# Altium schematic sheet EVK-NORA-W1_SCHEM_0002_Power.SchDoc
size B; Date: 7/24/2020; CompanyName: U-blox; DrawnBy: EMOO; Engineer: EMOO; Organization: U-blox; Address1: 3950 Fairview Industrial Dr SE #100; Address2: Salem, OR 97302; SheetNumber: 2; SheetTotal: 6; SheetSize: B; SheetTitle: Power
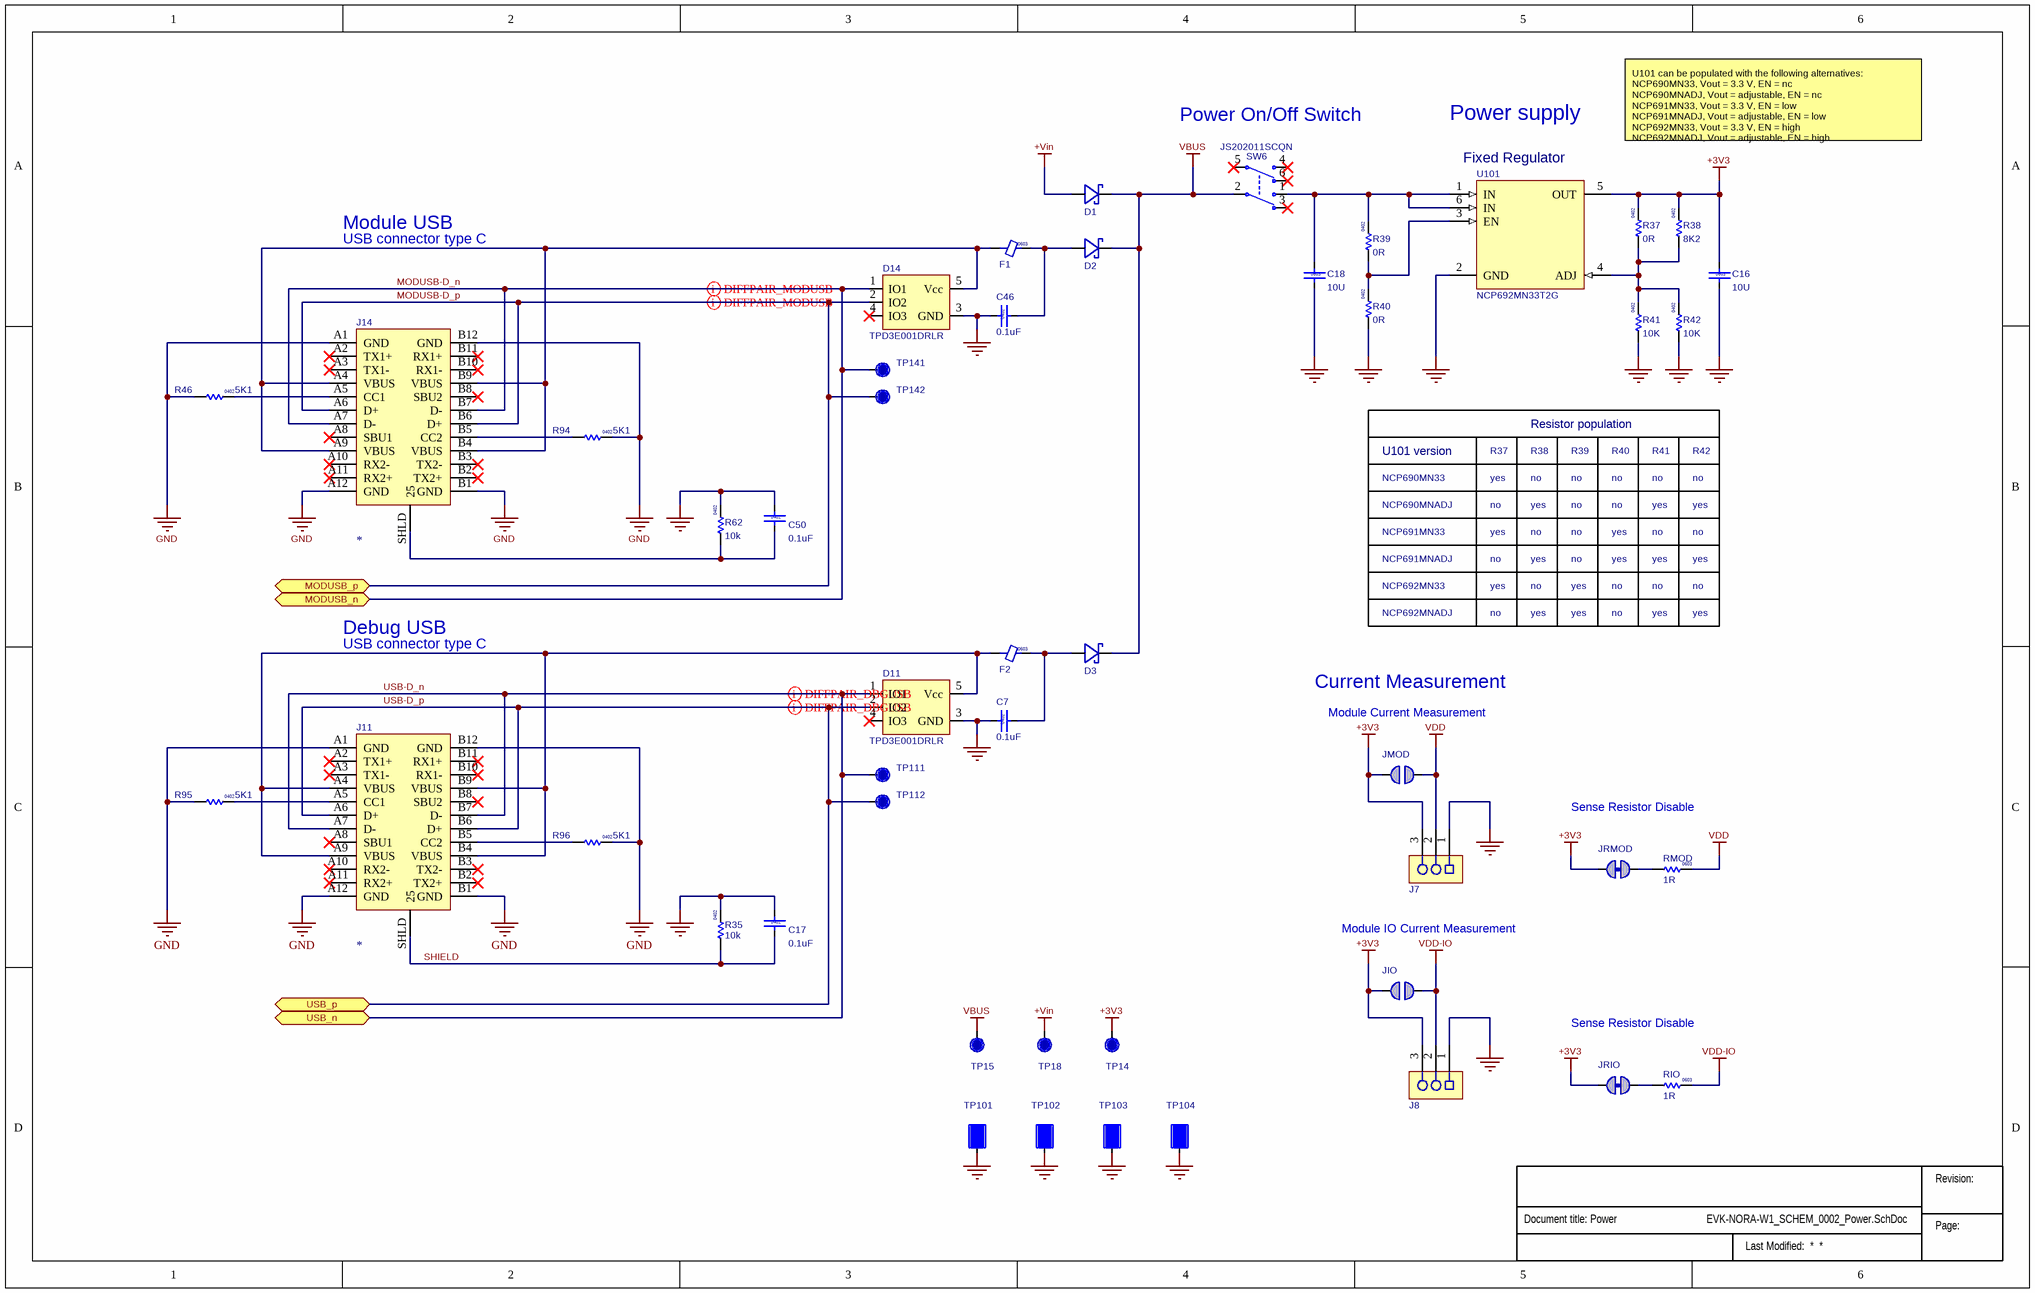
[diagram p0: EVK-NORA-W1_SCHEM_0002_Power.SchDoc]

## Parts
?  (no value)  (graphical)
C7  value 0.1uF  Size: 0402  [Cap 0402 HD]  (hidden comment: 120-000160.1uF)
C16  value 10U  Size: 0603  [Cap 0603 HD]
C17  value 0.1uF  Size: 0402  [Cap 0402 HD]  (hidden comment: 120-000160.1uF)
C18  value 10U  Size: 0603  [Cap 0603 HD]
C46  value 0.1uF  Size: 0402  [Cap 0402 HD]  (hidden comment: 120-000160.1uF)
C50  value 0.1uF  Size: 0402  [Cap 0402 HD]  (hidden comment: 120-000160.1uF)
D1  (no value)  [SOD-123F_U]
D2  (no value)  [SOD-123F_U]
D3  (no value)  [SOD-123F_U]
D11  Manufacturer P/N: TPD3E001DRLR  [SOT-553]  (hidden comment: 110-00018)
D14  Manufacturer P/N: TPD3E001DRLR  [SOT-553]  (hidden comment: 110-00018)
F1  Size: 0603  [IND 0603 HD]
F2  Size: 0603  [IND 0603 HD]
J7  130-00105  [HDR-0.1P-3Pin-1Row-SMT]  (value not drawn)
J8  130-00105  [HDR-0.1P-3Pin-1Row-SMT]  (value not drawn)
J11  (no value)  [CON_USB-C-RA_W-6Tabs]
J14  (no value)  [CON_USB-C-RA_W-6Tabs]
JIO  Solderbridge-OpenDNP  [Solderbridge-Open]  (value not drawn)  (no BOM)
JMOD  Solderbridge-OpenDNP  [Solderbridge-Open]  (value not drawn)  (no BOM)
JRIO  Solderbridge-ShortDNP  [Solderbridge-Short]  (value not drawn)  (net tie, no BOM)
JRMOD  Solderbridge-ShortDNP  [Solderbridge-Short]  (value not drawn)  (net tie, no BOM)
R35  value 10k  Size: 0402  [RES 0402 HD]  (hidden comment: 180-0002410k)
R37  value 0R  Size: 0402  [RES 0402 HD]
R38  value 8K2  Size: 0402  [RES 0402 HD]
R39  value 0R  Size: 0402  [RES 0402 HD]
R40  value 0R  Size: 0402  [RES 0402 HD]
R41  value 10K  Size: 0402  [RES 0402 HD]
R42  value 10K  Size: 0402  [RES 0402 HD]
R46  value 5K1  Size: 0402  [RES 0402 HD]
R62  value 10k  Size: 0402  [RES 0402 HD]  (hidden comment: 180-0002410k)
R94  value 5K1  Size: 0402  [RES 0402 HD]
R95  value 5K1  Size: 0402  [RES 0402 HD]
R96  value 5K1  Size: 0402  [RES 0402 HD]
RIO  value 1R  Size: 0603  [RES 0603 HD]  (hidden comment: 180-001091R)
RMOD  value 1R  Size: 0603  [RES 0603 HD]  (hidden comment: 180-001091R)
SW6  Manufacturer P/N: JS202011SCQN  [SW_Slide_DPDT_JS202011SCQN]  (hidden comment: 137-00006)
TP14  TP  [TP10R]  (value not drawn)  (no BOM)
TP15  TP  [TP10R]  (value not drawn)  (no BOM)
TP18  TP  [TP10R]  (value not drawn)  (no BOM)
TP101  TP4.5x3SqDNP  [TP4.5x3Sq]  (value not drawn)  (no BOM)
TP102  TP4.5x3SqDNP  [TP4.5x3Sq]  (value not drawn)  (no BOM)
TP103  TP4.5x3SqDNP  [TP4.5x3Sq]  (value not drawn)  (no BOM)
TP104  TP4.5x3SqDNP  [TP4.5x3Sq]  (value not drawn)  (no BOM)
TP111  TP  [TP10R]  (value not drawn)  (no BOM)
TP112  TP  [TP10R]  (value not drawn)  (no BOM)
TP141  TP  [TP10R]  (value not drawn)  (no BOM)
TP142  TP  [TP10R]  (value not drawn)  (no BOM)
U101  NCP692MN33T2G  [DFN-PSON.1P3X3-7pin_HS-7N]

## Ports
MODUSB_n (bidir), MODUSB_p (bidir), USB_n (bidir), USB_p (bidir)

## Nets
+3V3: C16.1 J7.3 J8.3 JIO.2 JMOD.2 JRIO.2 JRMOD.2 R37.2 R38.2 TP14.1 U101.5(OUT)
+Vin: D1.A(Anode) TP18.1
GND: C7.1 C16.2 C17.1 C18.2 C46.1 C50.1 D11.3(GND) D14.3(GND) J7.1 J8.1 J11.A1(GND) J11.A12(GND) J11.B1(GND) J11.B12(GND) J14.A1(GND) J14.A12(GND) J14.B1(GND) J14.B12(GND) R35.2 R40.1 R41.1 R42.1 R46.1 R62.2 R94.2 R95.1 R96.2 TP101.1 TP102.1 TP103.1 TP104.1 U101.2(GND)
VBUS: D1.C(Cathode) D2.C(Cathode) D3.C(Cathode) SW6.2(COM-1) TP15.1
VDD: J7.2 JMOD.1 RMOD.2
VDD-IO: J8.2 JIO.1 RIO.2
MODUSB-D_n: D14.1(IO1) J14.A7(D-) J14.B7(D-) TP141.1 ; port MODUSB_n
MODUSB-D_p: D14.2(IO2) J14.A6(D+) J14.B6(D+) TP142.1 ; port MODUSB_p
SHIELD: C17.2 J11.SHLD(25) R35.1
USB-D_n: D11.1(IO1) J11.A7(D-) J11.B7(D-) TP111.1 ; port USB_n
USB-D_p: D11.2(IO2) J11.A6(D+) J11.B6(D+) TP112.1 ; port USB_p
NetC7_2: C7.2 D3.A(Anode) F2.2
NetC18_1: C18.1 R39.2 SW6.1(N.O-1) U101.1(IN) U101.6(IN)
NetC46_2: C46.2 D2.A(Anode) F1.2
NetC50_2: C50.2 J14.SHLD(25) R62.1
NetD11_5: D11.5(Vcc) F2.1 J11.A4(VBUS) J11.A9(VBUS) J11.B4(VBUS) J11.B9(VBUS)
NetD14_5: D14.5(Vcc) F1.1 J14.A4(VBUS) J14.A9(VBUS) J14.B4(VBUS) J14.B9(VBUS)
NetJ11_A5: J11.A5(CC1) R95.2
NetJ11_B5: J11.B5(CC2) R96.1
NetJ14_A5: J14.A5(CC1) R46.2
NetJ14_B5: J14.B5(CC2) R94.1
NetJRIO_1: JRIO.1 RIO.1
NetJRMOD_1: JRMOD.1 RMOD.1
NetR37_1: R37.1 R38.1 R41.2 R42.2 U101.4(ADJ)
NetR39_1: R39.1 R40.2 U101.3(EN)

Not connected (* = marked no-connect by the designer): D11 4(IO3)*; D14 4(IO3)*; J11 A2(TX1+)* A3(TX1-)* A8(SBU1)* A10(RX2-)* A11(RX2+)* B2(TX2+)* B3(TX2-)* B8(SBU2)* B10(RX1-)* B11(RX1+)*; J14 A2(TX1+)* A3(TX1-)* A8(SBU1)* A10(RX2-)* A11(RX2+)* B2(TX2+)* B3(TX2-)* B8(SBU2)* B10(RX1-)* B11(RX1+)*; SW6 3(N.C-1)* 4(N.O-2)* 5(COM-2)* 6(N.C-2)*

## Layout directives
differential pair; net class USB_DIFF: MODUSB-D_n, MODUSB-D_p, USB-D_n, USB-D_p

## Notes on the sheet
- (near SW6) Power On/Off Switch
- Power supply
- (near U101) Fixed Regulator
- U101 can be populated with the following alternatives:
  NCP690MN33, Vout = 3.3 V, EN = nc
  NCP690MNADJ, Vout = adjustable, EN = nc
  NCP691MN33, Vout = 3.3 V, EN = low
  NCP691MNADJ, Vout = adjustable, EN = low
  NCP692MN33, Vout = 3.3 V, EN = high
  NCP692MNADJ, Vout = adjustable, EN = high
- Module USB
- USB connector type C
- Resistor population
- NCP690MN33
- NCP690MNADJ
- U101 version
- R37
- yes
- no
- R38
- R39
- R40
- R41
- R42
- NCP691MN33
- NCP691MNADJ
- Debug USB
- NCP692MN33
- NCP692MNADJ
- Current Measurement
- Module Current Measurement
- Sense Resistor Disable
- Module IO Current Measurement
- Revision:
- Page:

## Library data of the parts
? = Sub_Title_Block: Minimized schematic title block for all subset sheets
C7 C17 C46 C50 = 120-00016: Cap, Ceramic 0.1uF 10V 10% X5R 0402; Part Name: CAP CER 0.1UF 10V 10% X5R 0402; Part_Type: Ceramic Capacitor; Manufacturer: Murata Electronics North America; Manufacturer P/N: GRM155R61A104KA01J; Item_Phase: Production; Component Mounting Type: SMT; Tolerance: +/- 10%; Use in new designs: Yes; Part Number: 120-00016; Revision: 0A; Supplier 1: Digi-Key; Supplier Part Number 1: 490-6297-1-ND; Manufacturer 2: Yageo; Manufacturer P/N 2: CC0402KRX5R6BB104; Supplier 2: Digi-Key; Supplier Part Number 2: 311-1336-1-ND; Arena Link: https://app.bom.com/a/GYHPV2L2L43KRMBK?v=spec.summary; Height: 0.55mm; Pins: 2; Temperature Coefficient: X5R; Voltage: 10V
C16 C18 = UBXH01-0000310: CAP CER X7R 0603 10U 20% 10V; Manufacturer: Murata Manufacturing Company, Ltd.; Manufacturer P/N: GRM188Z71A106MA73; Editor: michael.hein; Released by: martin.grasse; Env: ROHS; Permitted Use: Volume Products; Perferred: PREF; Mfg P/N Status: Active; Mfg P/N Split: 100; Mfg P/N Released: Yes; Part Number: UBXH01-0000310; Tolerance: 20%; Max Voltage: 10V; Min Operating Temp: -55°C; Max Operating Temp: 125°C; Part Type: Capacitor; Release Data: 2017-02-09 11:14:05.871832; UBX Wiki: https://wiki.u-blox.com/bin/view/Operations/PartDetails?index=26280; RefDes: C; Mfg P/N Datasheet: https://wiki.u-blox.com/bin/view/Generic/Docs/DocumentSummary?index=26282; Manufacturer 2: Murata Manufacturing Company, Ltd.; Manufacturer P/N 2: GRM188Z71A106KA73; Mfg P/N Status 2: Active; Mfg P/N Split 2: 0; Mfg P/N Released 2: Yes; Mfg P/N Datasheet 2: https://wiki.u-blox.com/bin/view/Generic/Docs/DocumentSummary?index=28416
D1-D3 = 110-00005: Diode, Schottky, 20V 1A SOD-123F, 340mV Vf @ 1A / MBR120VLSFT3G; Manufacturer 1: ON Semiconductor; Part Name: Diode Schottky 20V 1A SOD-123FL; Body Size: None; Item Phase: In Production; MFG Package: SOD-123FL; Use in new designs: Yes; Part Number: 110-00005; Manufacturer Part Number 1: MBR120VLSFT3G; Supplier 1: Digi-Key; Supplier Part Number 1: MBR120VLSFT3GOSCT-ND; Manufacturer 2: None; Manufacturer Part Number 2: None; Supplier 2: None; Supplier Part Number 2: None; Current: 1A; Height: 0.98mm; Max Operating Temp: 125; Min Operating Temp: -65; Pins: 2; Revision: 0B; Voltage: 20V; UBX Code: None
D11 D14 = 110-00018: LOW-CAPACITANCE 3-CHANNEL ESD-PROTECTION ARRAY; Part Name: TVS Diode, 3CH High Speed ESD; Part_Type: Diode; Manufacturer: Texas Instruments; Item_Phase: Production; Body Size: 1.6mm x 1.2mm; Component Mounting Type: SMT; Diode Type: TVS; Use in new designs: Yes; Voltage: 5V; Part Number: 110-00018; Revision: 0A; Supplier 1: Digi-Key; Supplier Part Number 1: 296-21885-1-ND; Arena Link: https://app.bom.com/a/UCV39GZGZIHX50AE?v=spec.summary; Height: .55mm; MFG Package: SOT-553; Package Type: SOT; Pins: 5
F1 F2 = UBXH08-0000001: FERRITE BEAD 0603 600 OHM AT 100MHZ 600OHM 500mA; Manufacturer: TDK Corporation; Manufacturer P/N: MMZ1608B601C; Editor: daniel.hurni; Released by: martin.frauchiger; Env: ROHS; Permitted Use: Support Products; Perferred: PREF; Mfg P/N Status: Active; Mfg P/N Split: 100; Mfg P/N Released: Yes; Part Number: UBXH08-0000001; Value: 600OHM; Max Current: 500mA; Min Operating Temp: -40°C; Max Operating Temp: 125°C; Part Type: Ferrite; Release Data: 2009-12-02 10:18:36.177919; UBX Wiki: https://wiki.u-blox.com/bin/view/Operations/PartDetails?index=7960; RefDes: FB; Mfg P/N Datasheet: https://wiki.u-blox.com/bin/view/Generic/Docs/DocumentSummary?index=7941
J7 J8 = 130-00105: Header, 0.100" Pitch, 3 Pin, Vertical SMT; Manufacturer P/N: M20-8770342; Part Name: CON HDR 0.1" 3 Pin SMT; Part_Type: Connector; Manufacturer: Harwin Inc; Item_Phase: Preliminary; Keyed: No; Rows: 1; Use in new designs: Yes; Part Number: 130-00105; Supplier 1: Digi-Key; Supplier Part Number 1: 952-1951-ND; Arena Link: https://app.bom.com/a/BTCKQXGXGZYCIWHE?v=spec.summary; Color: Black; Component Mounting Type: SMT; Connector Type: Header; Height: 9.93mm; Length: 7.62mm; Locking: No; Pin Pitch: 0.100"; Pins: 3; Width: 5.08mm
J11 J14 = 130-00150: Connector, USB-C Receptacle, 24 Position, Surface Mount, Right Angle, Horizontal, 20V; Manufacturer 1: JAE Electronics; Manufacturer Part Number 1: DX07S024JJ3R1300; Part Name: CON USB C 0.5 mm 24 Pin 2 Row Right Angle White; Item Phase: Unreleased; Use in new designs: Yes; UBX Code: None; Manufacturer P/N: *; Part Number: 130-00150; Supplier 1: Digi-Key; Supplier Part Number 1: 670-2846-1-ND; Diameter: None; Height: 3.29mm; Max Operating Temp: 80; Min Operating Temp: -30; Pins: 24; Revision: None; Voltage: 20V; Manufacturer 2: None; Manufacturer Part Number 2: None; Supplier 2: None; Supplier Part Number 2: None
JIO JMOD = Solderbridge-Open: Added By: Paul B; Part Number: Solderbridge-Open; Height: 0; DNP: DNP; Added Date: 12/2/2015
JRIO JRMOD = Solderbridge-Short: Added By: Paul B; Part Number: Solderbridge-Short; Height: 0; DNP: DNP; Added Date: 12/2/2015
R35 R62 = 180-00024: Resistor 10k ohm 1% 1/16W, 0402; Part Name: RES SMD 10K OHM 1% 1/16W 0402; Manufacturer: Rohm Semiconductor; Manufacturer P/N: MCR01MRTF1002; Item_Phase: Production; Component Mounting Type: SMT; Tolerance: +/- 1%; Use in new designs: Yes; Part Number: 180-00024; Part_Type: Resistor; Revision: 0A; Supplier 1: Digi-Key; Supplier Part Number 1: RHM10.0KCDCT-ND; Manufacturer 2: Samsung Electro-Mechanics America, Inc; Manufacturer P/N 2: RC1005F103CS; Arena Link: https://app.bom.com/a/0I19FM5M5ON4B4RQ?v=spec.summary; Height: 0.4mm; Pins: 2; Power: 1/16W; Voltage: N/A
R37 R39 R40 = UBXH18-0003002: RES THICK FILM CHIP 0402 0R 0 100mW; Manufacturer: KOA; Manufacturer P/N: RK73Z1ETTD; Tolerance: 0; Editor: charlotte.biber; Released by: peter.mueller; Env: ROHS; Permitted Use: Volume Products; Perferred: PREF; Mfg P/N Status: NRND; Mfg P/N Split: 100; Mfg P/N Released: Yes; Part Number: UBXH18-0003002; Max Power: 100mW; Part Type: Resistor; Release Data: 2012-06-05 09:49:55.978616; UBX Wiki: https://wiki.u-blox.com/bin/view/Operations/PartDetails?index=6611; RefDes: R; Manufacturer 2: YAGEO; Manufacturer P/N 2: 2322_705_91001_L; Mfg P/N Status 2: NRND; Mfg P/N Split 2: 0; Mfg P/N Released 2: Yes
R38 = UBXH18-0000138: RES THICK FILM CHIP 0402 8K2 1% 63mW; Manufacturer: Vishay; Manufacturer P/N: CRCW04028K20FKED; Editor: matej.budin; Released by: pasquale.scorca; Env: ROHS; Permitted Use: Support Products; Perferred: PREF; Mfg P/N Status: Active; Mfg P/N Split: 100; Mfg P/N Released: Yes; Part Number: UBXH18-0000138; Tolerance: 1%; Max Power: 63mW; Min Operating Temp: -55°C; Max Operating Temp: 125°C; Part Type: Resistor; Release Data: 2014-08-26 11:33:33.796911; UBX Wiki: https://wiki.u-blox.com/bin/view/Operations/PartDetails?index=21078; RefDes: R; Mfg P/N Datasheet: https://wiki.u-blox.com/bin/view/Generic/Docs/DocumentSummary?index=21077
R41 R42 = UBXH18-0000065: RES THICK FILM CHIP 0402 10K 1% 63mW; Manufacturer: KOA; Manufacturer P/N: RK73H1ETTP1002F; Editor: erian.bezhani; Released by: massimo.vlacci; Env: ROHS; Permitted Use: Volume Products; Perferred: PREF; Mfg P/N Status: Active; Mfg P/N Split: 100; Mfg P/N Released: Yes; Part Number: UBXH18-0000065; Tolerance: 1%; Max Power: 63mW; Part Type: Resistor; Release Data: 2012-06-08 18:02:21.521517; UBX Wiki: https://wiki.u-blox.com/bin/view/Operations/PartDetails?index=16837; RefDes: R; Mfg P/N Datasheet: https://wiki.u-blox.com/bin/view/Generic/Docs/DocumentSummary?index=8222
R46 R94-R96 = UBXH18-0008066: RES THICK FILM CHIP 0402 5K1 5% 100mW; Manufacturer: Panasonic; Manufacturer P/N: ERJ-2GEJ512X; Editor: alvaro.nussbaum; Released by: roland.rust; Env: ROHS; Permitted Use: Internal Use; Perferred: NONPREF; Mfg P/N Status: Active; Mfg P/N Split: 100; Mfg P/N Released: No; Part Number: UBXH18-0008066; Tolerance: 5%; Max Power: 100mW; Part Type: Resistor; Release Data: 2016-02-11T15:22:01; UBX Wiki: https://wiki.u-blox.com/bin/view/Operations/PartDetails?index=6972; RefDes: R
RIO RMOD = 180-00109: Resistor 1 ohm 1%, 1/10W, 0603; Part Name: RES SMD 1 OHM 1% 1/10W 0603; Manufacturer: Samsung Electro-Mechanics America, Inc; Manufacturer P/N: RC1608F1R0CS; Item_Phase: Preliminary; Component Mounting Type: SMT; Tolerance: +/- 1%; Use in new designs: Yes; Part Number: 180-00109; Part_Type: Resistor; Supplier 1: Digi-Key; Supplier Part Number 1: 1276-4471-1-ND; Manufacturer 2: Yageo; Manufacturer P/N 2: RC0603FR-071RP; Supplier 2: Digi-Key; Supplier Part Number 2: YAG1295CT-ND; Arena Link: https://app.bom.com/a/Q8RZ5CVCVEDTXJ3Q?v=spec.summary; Height: 0.55mm; Pins: 2; Power: 1/10W
SW6 = 137-00006: SWITCH SLIDE DPDT 300MA 6V SMD; Manufacturer: C&K Components; Item_Phase: Preliminary; Component Mounting Type: SMT; Switch/Button Function: On-On; Use in new designs: Yes; Part Number: 137-00006; Part Name: SWITCH SLIDE DPDT 300MA 6V SMD; Part_Type: Switch; Supplier 1: Digi-Key; Supplier Part Number 1: 401-2002-1-ND; Arena Link: https://app.bom.com/a/5N6EKRARATS6M48O?v=spec.summary; Color: Silver; Current: 300mA; Height: 5.5mm; Length: 9mm; Pins: 6; Switch/Button Circuit: DPDT; Voltage: 6V; Width: 3.6mm
TP14 TP15 TP18 TP111 TP112 TP141 TP142 = TP10R: Testpoint, Round 1.0mm Dia; Added By: Jeremy D; Part Number: TP10R; Size: 1.0mm; Height: 0; DNP: DNP; Added Date: 2/1/2015; Checked By: Paul B; Checked Date: 2/5/2015
TP101-TP104 = TP4.5x3Sq: Testpoint, Rectangular 4.5mm x 3mm; Added By: Jeremy D; Part Number: TP4.5x3Sq; Size: 4.5mm x 3mm; Height: 0; DNP: DNP; Added Date: 8/21/2015
U101 = UBXH12-0000459: LOW DROPOUT REGULATOR ON SEMICONDUCTOR NCP692MN33T2G 6DFN 3.3V 6V 1A; Editor: hakan.ekfors; Released by: markus.wejrot; Env: ROHS; Permitted Use: Volume Products; Perferred: PREF; Mfg P/N Status: Active; Mfg P/N Split: 100; Mfg P/N Released: Yes; Part Number: UBXH12-0000459; Value: 3.3V; Max Voltage: 6V; Max Current: 1A; Min Operating Temp: -40°C; Max Operating Temp: 125°C; Part Type: Regulator; Release Data: 2021-08-23 15:14:48.502500; UBX Wiki: https://wiki.u-blox.com/bin/view/Operations/PartDetails?index=35423; RefDes: U; Manufacturer: ON Semiconductor; Manufacturer P/N: NCP692MN33T2G; Mfg P/N Datasheet: https://wiki.u-blox.com/bin/view/Generic/Docs/DocumentSummary?index=35425